# EAGLE design WeatherStation (EAGLE 7.1.0)

## Sheet 1 of 2
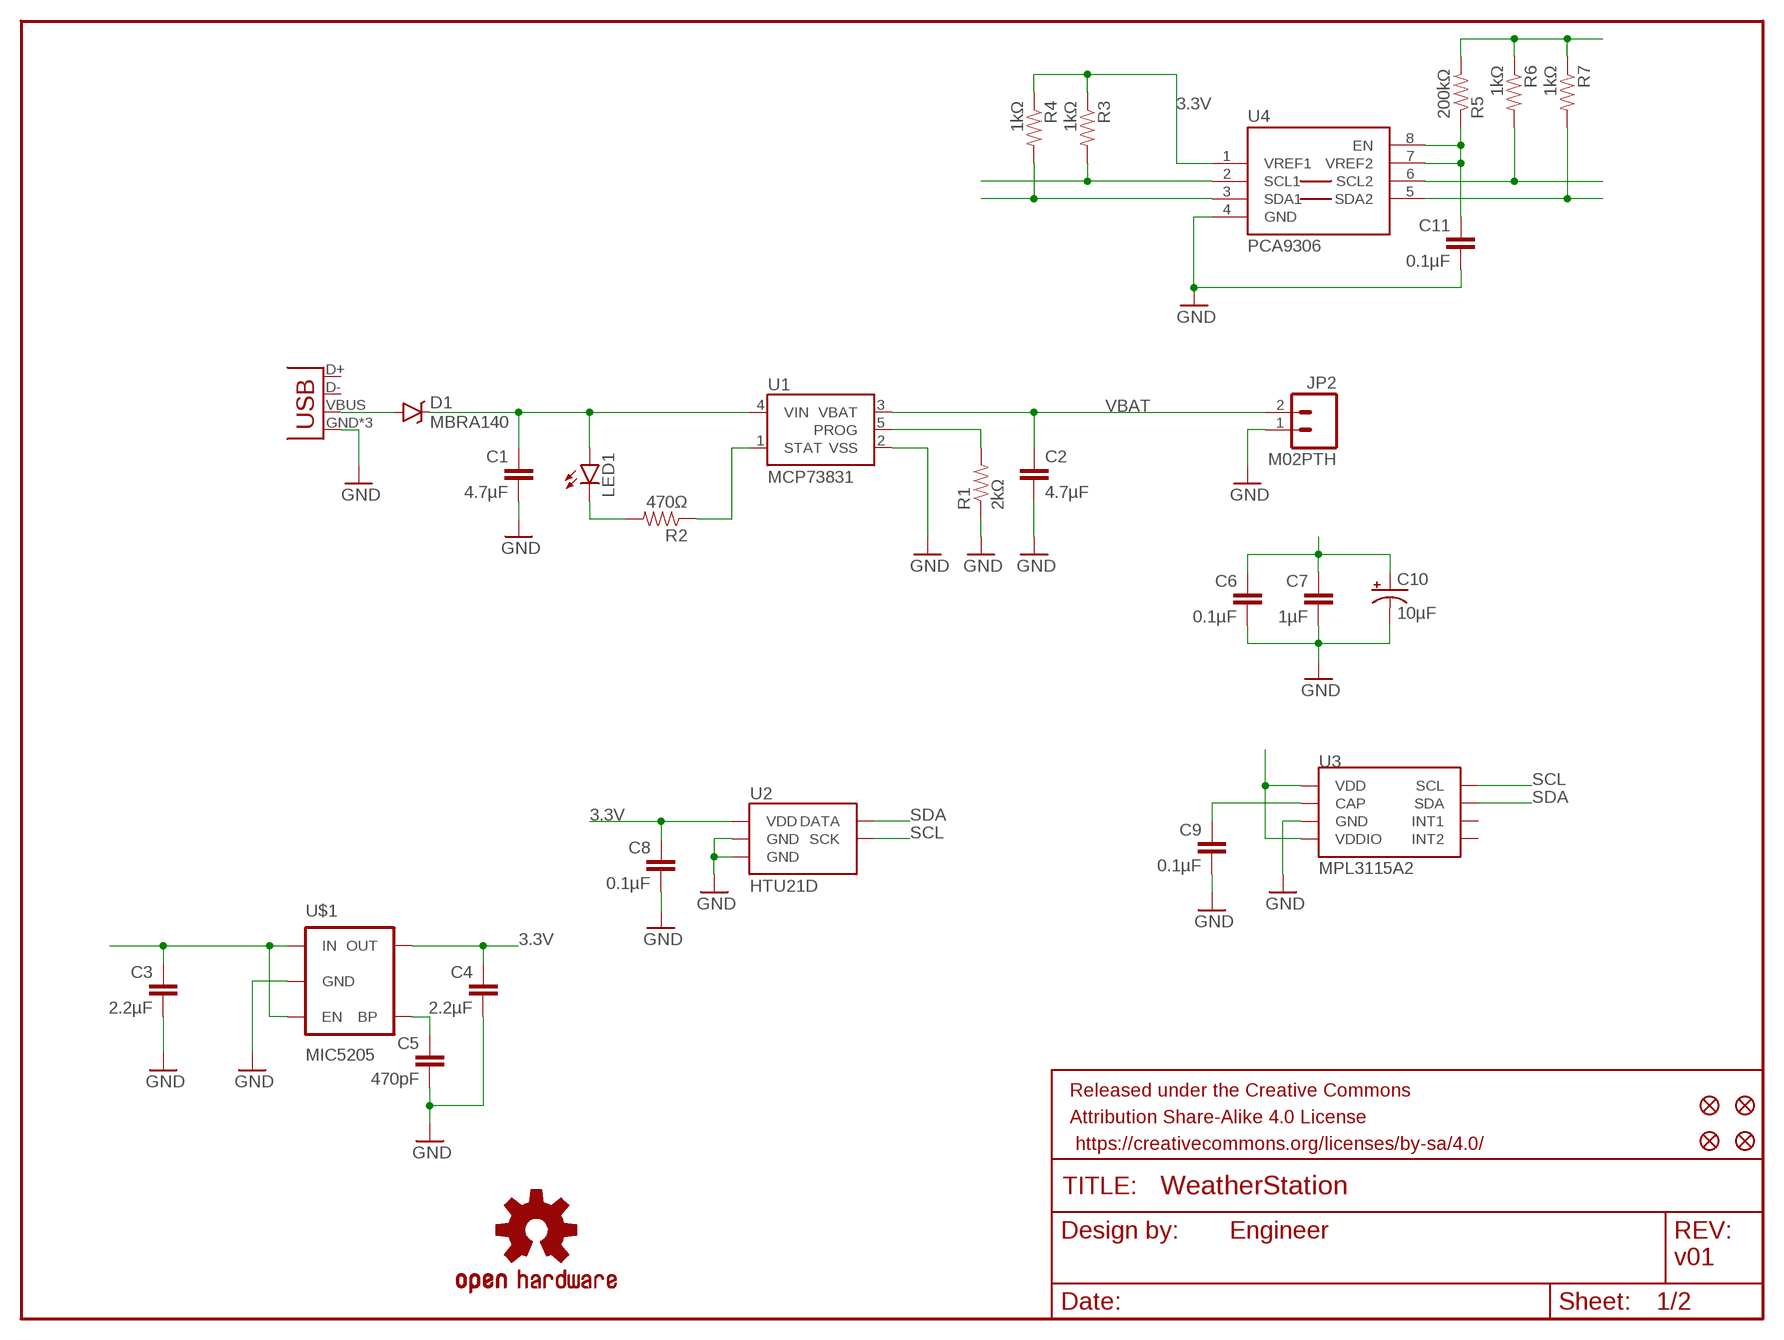
[diagram p0: schematic, sheet 1]

### Parts
C1  4.7µF  CAP0805  [0805]
C2  4.7µF  CAP0805  [0805]
C3  2.2µF  CAP0805  [0805]
C4  2.2µF  CAP0805  [0805]
C5  470pF  CAP0805  [0805]
C6  0.1µF  CAP0805  [0805]
C7  1µF  CAP0805  [0805]
C8  0.1µF  CAP0805  [0805]
C9  0.1µF  CAP0805  [0805]
C10  10µF  CAP_POL1206  [EIA3216]
C11  0.1µF  CAP0805  [0805]
D1  MBRA140  [SMA-DIODE]
FID1  FIDUCIAL1X2  [FIDUCIAL-1X2]
FID2  FIDUCIAL1X2  [FIDUCIAL-1X2]
FID3  FIDUCIAL1X2  [FIDUCIAL-1X2]
FID4  FIDUCIAL1X2  [FIDUCIAL-1X2]
FRAME1  FRAME-LETTER  [CREATIVE_COMMONS]
JP1  USB-MICROB  [USB-MICROB]
JP2  M02PTH  [1X02]
LED1  LED0603  [LED-0603]
LOGO1  OSHW-LOGOS  [OSHW-LOGO-S]
R1  2kΩ  RESISTOR0603-RES  [0603-RES]
R2  470Ω  RESISTOR0603-RES  [0603-RES]
R3  1kΩ  RESISTOR0603-RES  [0603-RES]
R4  1kΩ  RESISTOR0603-RES  [0603-RES]
R5  200kΩ  RESISTOR0603-RES  [0603-RES]
R6  1kΩ  RESISTOR0603-RES  [0603-RES]
R7  1kΩ  RESISTOR0603-RES  [0603-RES]
U1  MCP73831  [SOT23-5]
U2  HTU21D  HTU21DSMD  [HTU21D]
U3  MPL3115A2  MPL3115A2LGA8  [LGA8]
U4  PCA9306  [PSOP-8]
U$1  MIC5205  V_REG_MIC52053.3V  [SOT23-5]

### Nets
1.8V: R5.2 R6.1 R7.1 ; also sheet 2
3.3V: C4.1 C6.1 C7.1 C8.1 C10.A(+) R3.1 R4.1 U2.VDD U3.1(VDD) U3.4(VDDIO) U4.1(VREF1) U$1.5(OUT) ; also sheet 2
GND: C1.2 C2.2 C3.2 C4.2 C5.2 C6.2 C7.2 C8.2 C9.2 C10.C(-) C11.2 JP1.GND JP1.MT1(GND) JP1.MT2(GND) JP2.1 R1.1 U1.2(VSS) U2.7(GND) U2.GND U3.3(GND) U4.4(GND) U$1.2(GND) ; also sheet 2
N$1: D1.A JP1.VBUS
N$2: C1.1 D1.C LED1.A U1.4(VIN)
N$3: C9.1 U3.2(CAP)
N$4: LED1.C R2.2
N$5: R2.1 U1.1(STAT)
N$6: R1.2 U1.5(PROG)
N$8: C5.1 U$1.4(BP)
N$10: C11.1 R5.1 U4.7(VREF2) U4.8(EN)
N$11: R6.2 U4.6(SCL2)
N$12: R7.2 U4.5(SDA2)
SCL: R3.2 U2.SCK U3.8(SCL) U4.2(SCL1)
SDA: R4.2 U2.DATA U3.7(SDA) U4.3(SDA1)
VBAT: C2.1 C3.1 JP2.2 U1.3(VBAT) U$1.1(IN) U$1.3(EN)
Unconnected: JP1.D+ JP1.D- U3.5(INT2) U3.6(INT1)

### Notes on the sheet
- Engineer
- v01

## Sheet 2 of 2
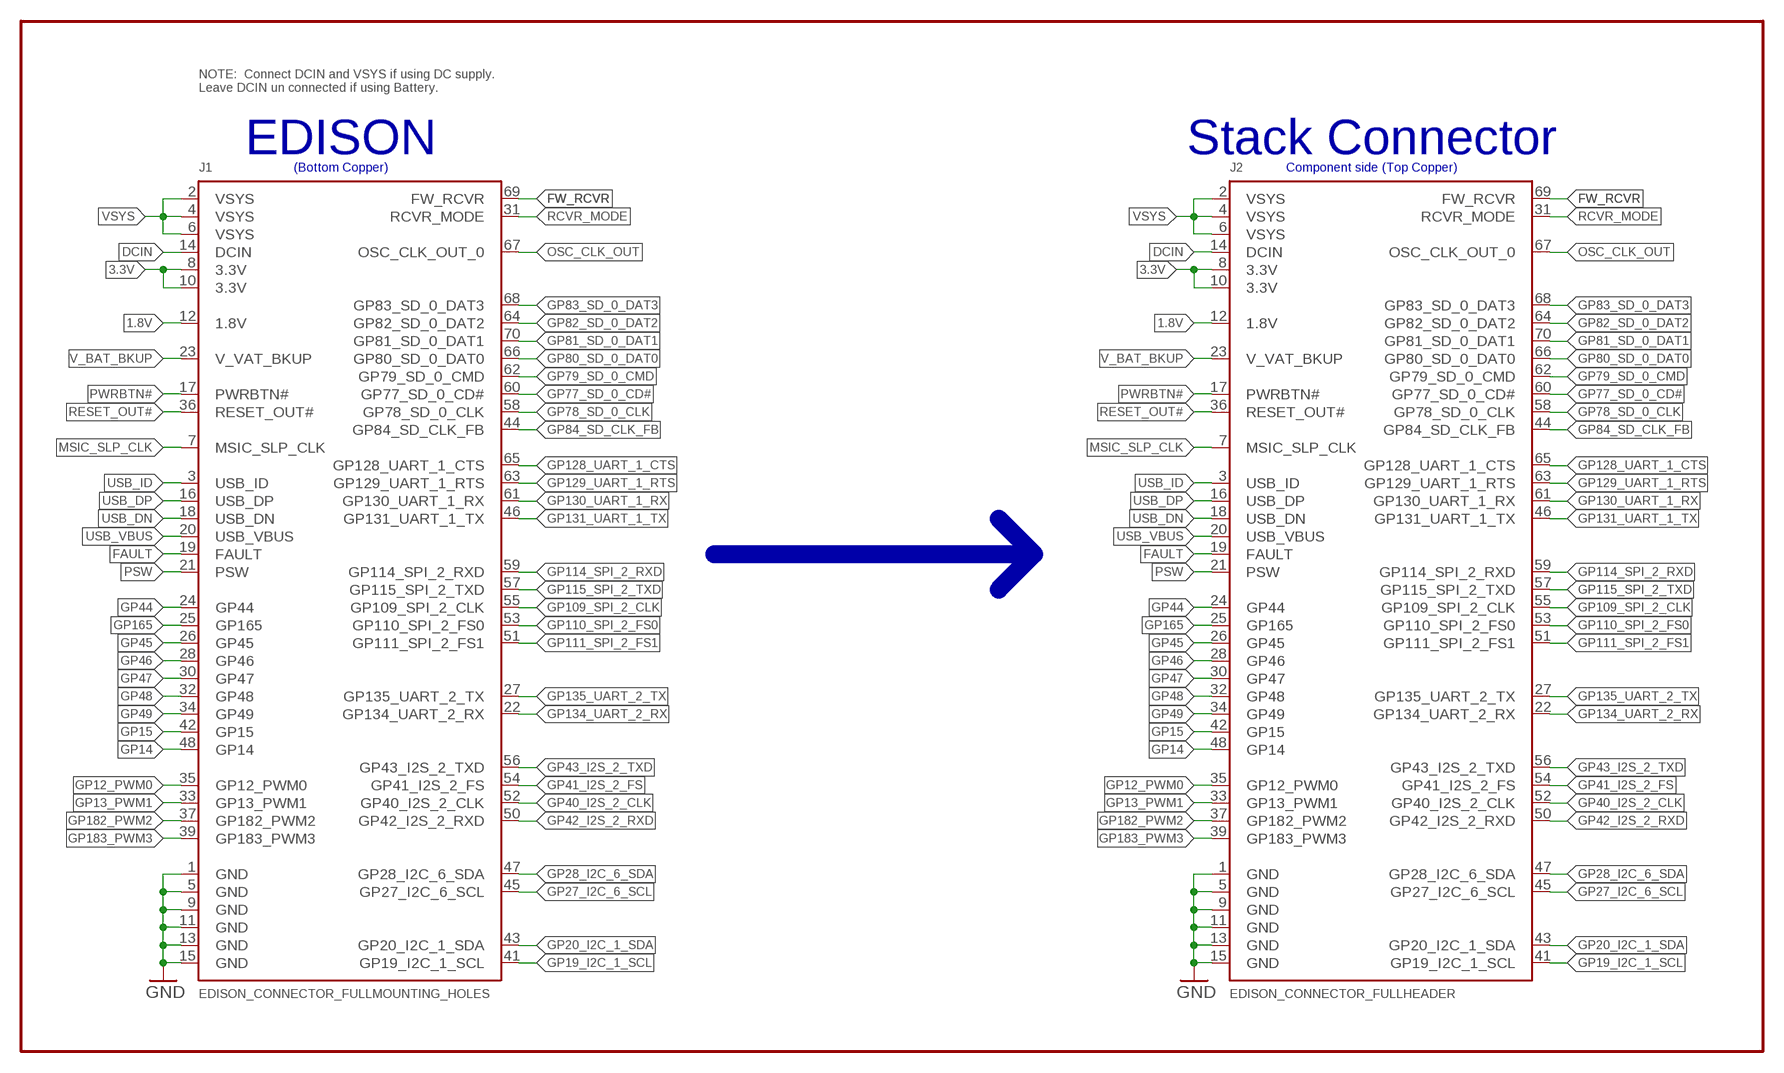
[diagram p1: schematic, sheet 2]

### Parts
J1  EDISON_CONNECTOR_FULLMOUNTING_HOLES  [EDISON_DAUGHTER]
J2  EDISON_CONNECTOR_FULLHEADER  [DF40C-70DP-0.4(51)]

### Nets
1.8V: J1.12(1.8V) J2.12(1.8V) ; also sheet 1
3.3V: J1.8(3.3V) J1.10(3.3V) J2.8(3.3V) J2.10(3.3V) ; also sheet 1
DCIN: J1.14(DCIN) J2.14(DCIN)
FAULT: J1.19(FAULT) J2.19(FAULT)
FW_RCVR: J1.69(FW_RCVR) J2.69(FW_RCVR)
GND: J1.1(GND) J1.5(GND) J1.9(GND) J1.11(GND) J1.13(GND) J1.15(GND) J2.1(GND) J2.5(GND) J2.9(GND) J2.11(GND) J2.13(GND) J2.15(GND) ; also sheet 1
GP12_PWM0: J1.35(GP12_PWM0) J2.35(GP12_PWM0)
GP13_PWM1: J1.33(GP13_PWM1) J2.33(GP13_PWM1)
GP14: J1.48(GP14) J2.48(GP14)
GP15: J1.42(GP15) J2.42(GP15)
GP19_I2C_1_SCL: J1.41(GP19_I2C_1_SCL) J2.41(GP19_I2C_1_SCL)
GP20_I2C_1_SDA: J1.43(GP20_I2C_1_SDA) J2.43(GP20_I2C_1_SDA)
GP27_I2C_6_SCL: J1.45(GP27_I2C_6_SCL) J2.45(GP27_I2C_6_SCL)
GP28_I2C_6_SDA: J1.47(GP28_I2C_6_SDA) J2.47(GP28_I2C_6_SDA)
GP40_I2S_2_CLK: J1.52(GP40_I2S_2_CLK) J2.52(GP40_I2S_2_CLK)
GP41_I2S_2_FS: J1.54(GP41_I2S_2_FS) J2.54(GP41_I2S_2_FS)
GP42_I2S_2_RXD: J1.50(GP42_I2S_2_RXD) J2.50(GP42_I2S_2_RXD)
GP43_I2S_2_TXD: J1.56(GP43_I2S_2_TXD) J2.56(GP43_I2S_2_TXD)
GP44: J1.24(GP44) J2.24(GP44)
GP45: J1.26(GP45) J2.26(GP45)
GP46: J1.28(GP46) J2.28(GP46)
GP47: J1.30(GP47) J2.30(GP47)
GP48: J1.32(GP48) J2.32(GP48)
GP49: J1.34(GP49) J2.34(GP49)
GP77_SD_0_CD#: J1.60(GP77_SD_0_CD#) J2.60(GP77_SD_0_CD#)
GP78_SD_0_CLK: J1.58(GP78_SD_0_CLK) J2.58(GP78_SD_0_CLK)
GP79_SD_0_CMD: J1.62(GP79_SD_0_CMD) J2.62(GP79_SD_0_CMD)
GP80_SD_0_DAT0: J1.66(GP80_SD_0_DAT0) J2.66(GP80_SD_0_DAT0)
GP81_SD_0_DAT1: J1.70(GP81_SD_0_DAT1) J2.70(GP81_SD_0_DAT1)
GP82_SD_0_DAT2: J1.64(GP82_SD_0_DAT2) J2.64(GP82_SD_0_DAT2)
GP83_SD_0_DAT3: J1.68(GP83_SD_0_DAT3) J2.68(GP83_SD_0_DAT3)
GP84_SD_CLK_FB: J1.44(GP84_SD_CLK_FB) J2.44(GP84_SD_CLK_FB)
GP109_SPI_2_CLK: J1.55(GP109_SPI_2_CLK) J2.55(GP109_SPI_2_CLK)
GP110_SPI_2_FS0: J1.53(GP110_SPI_2_FS0) J2.53(GP110_SPI_2_FS0)
GP111_SPI_2_FS1: J1.51(GP111_SPI_2_FS1) J2.51(GP111_SPI_2_FS1)
GP114_SPI_2_RXD: J1.59(GP114_SPI_2_RXD) J2.59(GP114_SPI_2_RXD)
GP115_SPI_2_TXD: J1.57(GP115_SPI_2_TXD) J2.57(GP115_SPI_2_TXD)
GP128_UART_1_CTS: J1.65(GP128_UART_1_CTS) J2.65(GP128_UART_1_CTS)
GP129_UART_1_RTS: J1.63(GP129_UART_1_RTS) J2.63(GP129_UART_1_RTS)
GP130_UART_1_RX: J1.61(GP130_UART_1_RX) J2.61(GP130_UART_1_RX)
GP131_UART_1_TX: J1.46(GP131_UART_1_TX) J2.46(GP131_UART_1_TX)
GP134_UART_2_RX: J1.22(GP134_UART_2_RX) J2.22(GP134_UART_2_RX)
GP135_UART_2_TX: J1.27(GP135_UART_2_TX) J2.27(GP135_UART_2_TX)
GP165: J1.25(GP165) J2.25(GP165)
GP182_PWM2: J1.37(GP182_PWM2) J2.37(GP182_PWM2)
GP183_PWM3: J1.39(GP183_PWM3) J2.39(GP183_PWM3)
MSIC_SLP_CLK: J1.7(MSIC_SLP_CLK) J2.7(MSIC_SLP_CLK)
OSC_CLK_OUT: J1.67(OSC_CLK_OUT_0) J2.67(OSC_CLK_OUT_0)
PSW: J1.21(PSW) J2.21(PSW)
PWRBTN#: J1.17(PWRBTN#) J2.17(PWRBTN#)
RCVR_MODE: J1.31(RCVR_MODE) J2.31(RCVR_MODE)
RESET_OUT#: J1.36(RESET_OUT#) J2.36(RESET_OUT#)
USB_DN: J1.18(USB_DN) J2.18(USB_DN)
USB_DP: J1.16(USB_DP) J2.16(USB_DP)
USB_ID: J1.3(USB_ID) J2.3(USB_ID)
USB_VBUS: J1.20(USB_VBUS) J2.20(USB_VBUS)
V_BAT_BKUP: J1.23(V_VAT_BKUP) J2.23(V_VAT_BKUP)
VSYS: J1.2(VSYS) J1.4(VSYS) J1.6(VSYS) J2.2(VSYS) J2.4(VSYS) J2.6(VSYS)

### Buses
B$1

### Notes on the sheet
- NOTE:  Connect DCIN and VSYS if using DC supply.
  Leave DCIN un connected if using Battery.
- EDISON | Stack Connector
- (Bottom Copper) | Component side (Top Copper)

## Library data of the parts
C1-C9 C11 = SparkFun-Capacitors:CAP: Capacitor Standard 0603 ceramic capacitor, and 0.1" leaded capacitor.
C10 = SparkFun-Capacitors:CAP_POL: Capacitor Polarized These are standard SMD and PTH capacitors. Normally 10uF, 47uF, and 100uF in electrolytic and tantalum varieties. Always verify the external diameter of the through hole cap, it varies with capacity, voltage, and manufacturer. The EIA devices should be standard.
D1 = SparkFun-DiscreteSemi:MBRA140: 40V, 1A Schottky rectifier SMA/DO-214AC package DIO-08053; PROD_ID: DIO-08053
FID1-FID4 = SparkFun-Aesthetics:FIDUCIAL: Fiducial Alignment Points Various fiducial points for machine vision alignment.
FRAME1 = SparkFun-Aesthetics:FRAME-LETTER: Schematic Frame Standard 8.5x11 US Letter frame
J1 J2 = Edison:EDISON_CONNECTOR_FULL
JP1 = SparkFun-Connectors:USB: USB Connectors USB-B-PTH is fully proven SKU : PRT-00139/CONN-08278 USB-miniB is fully proven SKU : PRT-00587 USB-A-PCB is untested. USB-A-H is throughly reviewed, but untested. Spark Fun Electronics SKU : PRT-00437 USB-B-SMT is throughly reviewed, but untested. Needs silkscreen touching up. USB-A-S has not been used/tested USB-MB-H has not been used/tested USB-MICROB has been used. CONN-09505; PROD_ID: CONN-09505
JP2 = SparkFun-Connectors:M02: Standard 2-pin 0.1" header. Use with - straight break away headers ( PRT-00116) - right angle break away headers (PRT-00553) - swiss pins (PRT-00743) - machine pins (PRT-00117) - female headers (PRT-00115) Molex polarized connector foot print use with: PRT-08233 with associated crimp pins and housings. 2.54_SCREWTERM for use with PRT-10571. 3.5mm Screw Terminal footprints for PRT-08084 5mm Screw Terminal footprints for use with PRT-08432
LED1 = SparkFun-LED:LED: LEDs Standard schematic elements and footprints for 5mm, 3mm, 1206, and 0603 sized LEDs. 5mm - Spark Fun Electronics SKU : COM-00529 (and others)
LOGO1 = SparkFun-Aesthetics:OSHW-LOGO: Open Source Hardware Logo This logo indicates the piece of hardware it is found on incorporates a OSHW license and/or adheres to the definition of open source hardware found here: http://freedomdefined.org/OSHW
R1-R7 = SparkFun-Resistors:RESISTOR: Resistor Basic schematic elements and footprints for 0603, 1206, and PTH resistors.
U1 = SparkFun-PowerIC:MCP73831: Miniature single cell, fully integrated Li-Ion, Li-polymer charge management controller http://ww1.microchip.com/downloads/en/DeviceDoc/21984a.pdf IC-09995; PROD_ID: IC-09995
U2 = SparkFun-Sensors:HTU21D
U3 = SparkFun-Sensors:MPL3115A2: Altimeter/Pressure Sensor, I2C, 1.95V-3.6V supply, 50 to 110kPa
U4 = SparkFun-DigitalIC:PCA9306: Bidirectional I2C level shifter. NOT compatible with all available part number pinout schemes- DOUBLE CHECK!!!; PROD_ID: IC-10023
U$1 = SparkFun-PowerIC:V_REG_MIC5205: V_REG MIC5219 Standard 3.3V and 5V 150mA LDO voltage regulator in SOT-23 layout. Micrel part MIC5205. BP (by-pass) pin is used to lower output noise with 470pF cap, may be left open.; PROD_ID: VREG-00822; VALUE: 3.3V/150mA

## Board
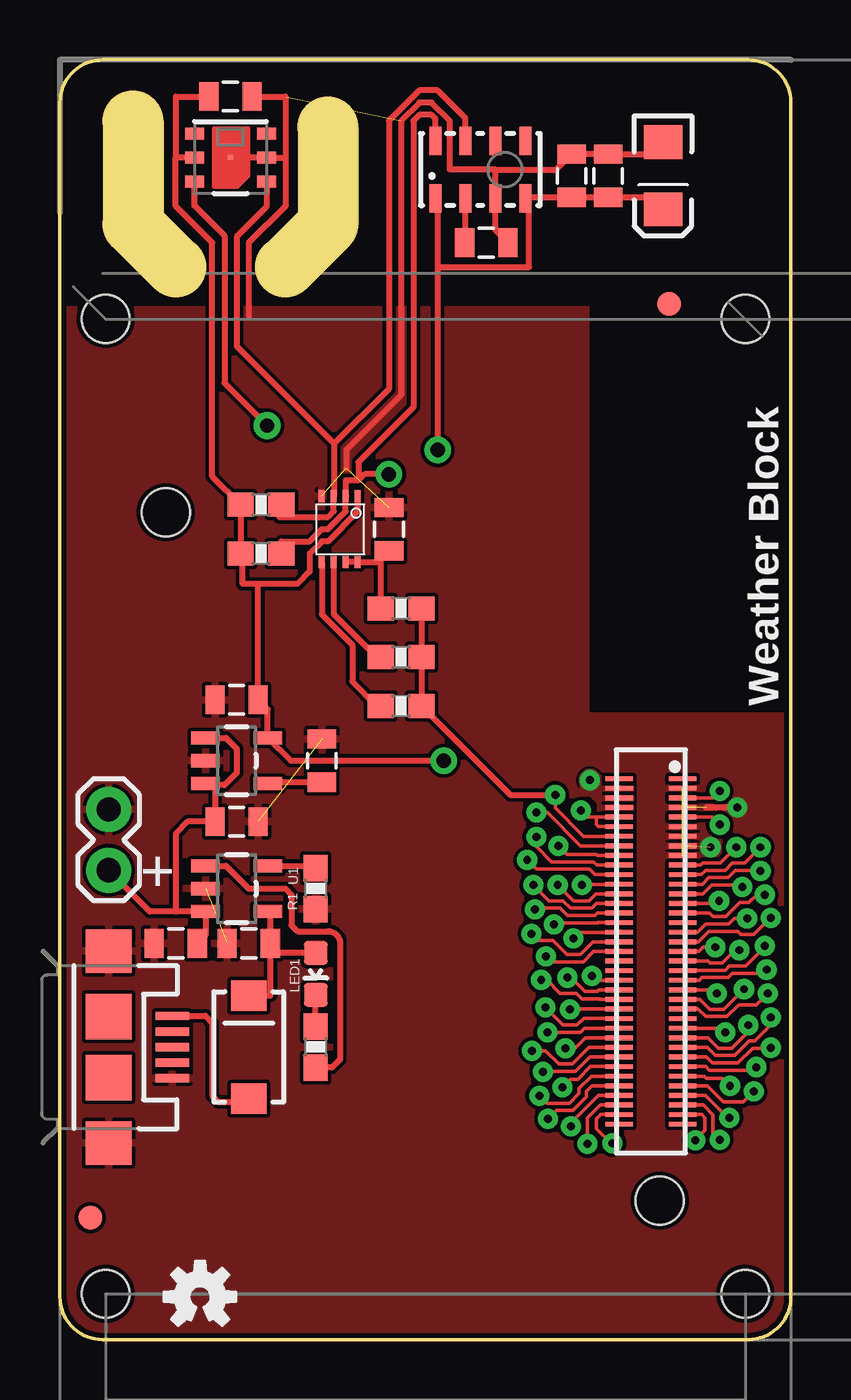
[diagram p2: board, top side]
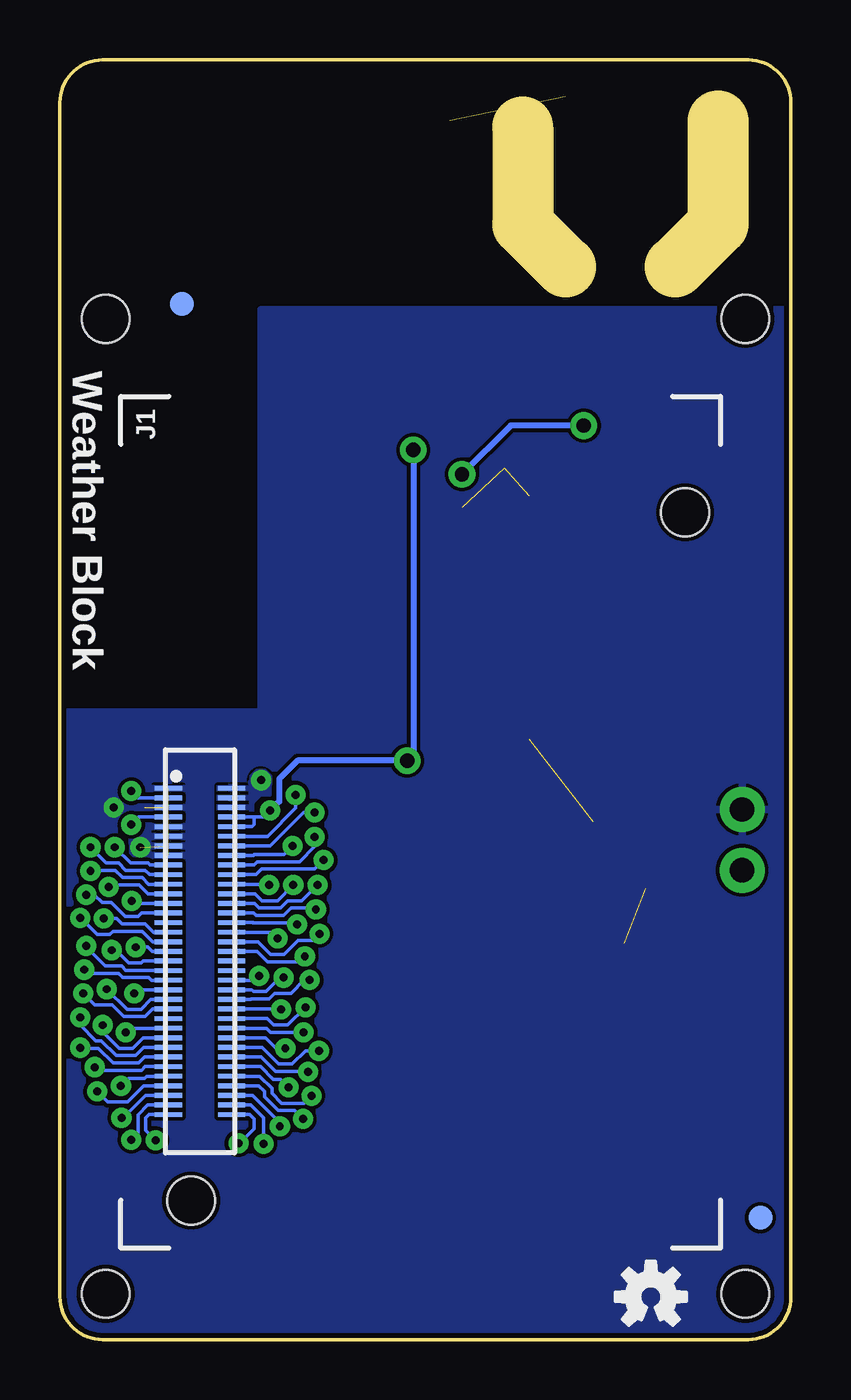
[diagram p3: board, bottom side, seen from below]

Size 30.48 x 53.34 mm. Coordinates in mm from the lower left corner, seen from the top.
Outline: 30.48,51.56 30.48,1.78 arc-90 28.7,0 1.78,0 arc-90 0,1.78 0,51.56 arc-90 1.78,53.34 28.7,53.34 arc-90 30.48,51.56
Copper layers (1*16): Top 0.035mm / dielectric 1.5mm / Bottom 0.035mm
Design rules "SparkFun-2-layer *": minimum track width 6mil, minimum drill 13mil, track to track 6mil, track to pad 6mil, pad to pad 6mil, via to via 6mil, smd to smd 6mil, copper to edge 8mil, drill to drill 8mil, minimum pad ring 12mil, minimum via ring 10mil, stop-mask expansion 4mil, vias tented up to drill 20mil, thermal gap 6mil
Holes 2 mm at 28.57,1.91 1.91,1.91 1.91,42.55 28.57,42.55
tRestrict: area 22.1,26.2 to 30.5,44.5
Milling: 4 lines

### Footprints (pad centres in the part's own frame; a part is rotated, then mirrored left to right if it is on the bottom)
0805 = smd 0.8 x 1.2: 1 -0.9,0; 2 0.9,0
EIA3216 = smd 1.4 x 1.6: A 1.4,0; C -1.4,0
SMA-DIODE = smd 1.27 x 1.47: A -2.15,0; C 2.15,0
FIDUCIAL-1X2 = smd 1 x 1: 1 0,0
EDISON_DAUGHTER = smd 1.14 x 0.2: 1 1.98,19.17; 2 4.62,19.17; 3 1.98,18.77; 4 4.62,18.77; 5 1.98,18.37; 6 4.62,18.37; 7 1.98,17.97; 8 4.62,17.97; 9 1.98,17.57; 10 4.62,17.57; 11 1.98,17.17; 12 4.62,17.17; 13 1.98,16.77; 14 4.62,16.77; 15 1.98,16.37; 16 4.62,16.37; 17 1.98,15.97; 18 4.62,15.97; 19 1.98,15.57; 20 4.62,15.57; 21 1.98,15.17; 22 4.62,15.17; 23 1.98,14.77; 24 4.62,14.77; 25 1.98,14.37; 26 4.62,14.37; 27 1.98,13.97; 28 4.62,13.97; 29 1.98,13.57; 30 4.62,13.57; 31 1.98,13.17; 32 4.62,13.17; 33 1.98,12.77; 34 4.62,12.77; 35 1.98,12.37; 36 4.62,12.37; 37 1.98,11.97; 38 4.62,11.97; 39 1.98,11.57; 40 4.62,11.57; 41 1.98,11.17; 42 4.62,11.17; 43 1.98,10.77; 44 4.62,10.77; 45 1.98,10.37; 46 4.62,10.37; 47 1.98,9.97; 48 4.62,9.97; 49 1.98,9.57; 50 4.62,9.57; 51 1.98,9.17; 52 4.62,9.17; 53 1.98,8.77; 54 4.62,8.77; 55 1.98,8.37; 56 4.62,8.37; 57 1.98,7.97; 58 4.62,7.97; 59 1.98,7.57; 60 4.62,7.57; 61 1.98,7.17; 62 4.62,7.17; 63 1.98,6.77; 64 4.62,6.77; 65 1.98,6.37; 66 4.62,6.37; 67 1.98,5.97; 68 4.62,5.97; 69 1.98,5.57; 70 4.62,5.57 | hole 2: 23.53,30.67; 2.93,1.98
DF40C-70DP-0.4(51) = smd 0.2 x 1.14 bottom: 1 6.8,1.32; 2 6.8,-1.32; 3 6.4,1.32; 4 6.4,-1.32; 5 6,1.32; 6 6,-1.32; 7 5.6,1.32; 8 5.6,-1.32; 9 5.2,1.32; 10 5.2,-1.32; 11 4.8,1.32; 12 4.8,-1.32; 13 4.4,1.32; 14 4.4,-1.32; 15 4,1.32; 16 4,-1.32; 17 3.6,1.32; 18 3.6,-1.32; 19 3.2,1.32; 20 3.2,-1.32; 21 2.8,1.32; 22 2.8,-1.32; 23 2.4,1.32; 24 2.4,-1.32; 25 2,1.32; 26 2,-1.32; 27 1.6,1.32; 28 1.6,-1.32; 29 1.2,1.32; 30 1.2,-1.32; 31 0.8,1.32; 32 0.8,-1.32; 33 0.4,1.32; 34 0.4,-1.32; 35 0,1.32; 36 0,-1.32; 37 -0.4,1.32; 38 -0.4,-1.32; 39 -0.8,1.32; 40 -0.8,-1.32; 41 -1.2,1.32; 42 -1.2,-1.32; 43 -1.6,1.32; 44 -1.6,-1.32; 45 -2,1.32; 46 -2,-1.32; 47 -2.4,1.32; 48 -2.4,-1.32; 49 -2.8,1.32; 50 -2.8,-1.32; 51 -3.2,1.32; 52 -3.2,-1.32; 53 -3.6,1.32; 54 -3.6,-1.32; 55 -4,1.32; 56 -4,-1.32; 57 -4.4,1.32; 58 -4.4,-1.32; 59 -4.8,1.32; 60 -4.8,-1.32; 61 -5.2,1.32; 62 -5.2,-1.32; 63 -5.6,1.32; 64 -5.6,-1.32; 65 -6,1.32; 66 -6,-1.32; 67 -6.4,1.32; 68 -6.4,-1.32; 69 -6.8,1.32; 70 -6.8,-1.32; NC1 7.2,1.32; NC2 7.2,-1.32; NC3 -7.2,-1.32; NC4 -7.2,1.32
USB-MICROB = smd 0.35 x 1.4: D+ 0,2.65; D- -0.65,2.65; GND 1.3,2.65; ID 0.65,2.65; VBUS -1.3,2.65 | smd 1.8 x 1.9: MT1 -4,0; MT2 4,0 | smd 1.9 x 1.9: P$1 -1.27,0; P$2 1.27,0
1X02 = drill 1.016 pad 1.88: 1 0,0; 2 2.54,0
LED-0603 = smd 1 x 1: A 0,-0.877; C 0,0.877
0603-RES = smd 1.1 x 1: 1 -0.85,0; 2 0.85,0
SOT23-5 = smd 0.55 x 1.2: 1 -0.95,-1.3; 2 0,-1.3; 3 0.95,-1.3; 4 0.95,1.3; 5 -0.95,1.3
HTU21D = smd 0.2 x 0.2: 7 0,0 | smd 0.8 x 0.5: DATA 1.5,-1; GND 1.5,0; NC@1 -1.5,1; NC@6 1.5,1; SCK -1.5,-1; VDD -1.5,0
LGA8 = smd 1.2 x 0.5: 1 -1.2,1.875; 2 -1.2,0.625; 3 -1.2,-0.625; 4 -1.2,-1.875; 5 1.2,-1.875; 6 1.2,-0.625; 7 1.2,0.625; 8 1.2,1.875
PSOP-8 = smd 0.25 x 0.5: 1 -0.73,-1.37; 2 -0.23,-1.37; 3 0.27,-1.37; 4 0.77,-1.37; 5 0.77,1.38; 6 0.27,1.38; 7 -0.23,1.38; 8 -0.73,1.38

### Placement (x,y rotation side)
C1  7.87,16.51 180 top
C2  4.83,16.51 180 top
C3  7.37,21.59 0 top
C4  7.37,26.67 180 top
C5  10.92,24.13 90 top
C6  21.34,48.51 90 top
C7  22.86,48.51 90 top
C8  7.11,51.82 0 top
C9  17.78,45.72 0 top
C10  25.15,48.51 270 top
C11  13.72,33.78 90 top
D1  7.87,12.19 90 top
FID1  1.27,5.08 0 top
FID2  25.4,43.18 0 top
FID3  1.27,5.08 0 bottom
FID4  25.4,43.18 0 bottom
FRAME1  -1.27,-13.97 0 top  (outside the outline)
J1  27.94,3.81 0 bottom
J2  24.64,16.18 90 bottom
JP1  2.03,12.19 270 top
JP2  2.03,22.1 270 top
LED1  10.67,15.24 180 top
LOGO1  5.84,1.78 0 top
LOGO2  OSHW-LOGOS  [OSHW-LOGO-S]  5.84,1.78 0 bottom
R1  10.67,18.8 90 top
R2  10.67,12.19 90 top
R3  8.38,32.77 0 top
R4  8.38,34.8 0 top
R5  14.22,30.48 0 top
R6  14.22,28.45 180 top
R7  14.22,26.42 180 top
U1  7.37,18.8 270 top
U2  7.11,49.28 0 top
U3  17.53,48.77 90 top
U4  11.68,33.78 180 top
U$1  7.37,24.13 270 top

### Tracks (layer width: path | path; a pad name or v marks a point on that pad's centre or on a via)
1.8V  (via drill 0.33)
  Top 0.152: J2.12 21.82,20.98 20.65,22.15 v20.65,22.71
  Top 0.254: R5.2 R6.1 R7.1 18.78,22.71 v20.65,22.71
  Bottom 0.152: v20.65,22.71 20.65,22.15 21.82,20.98 J2.12 | J2.12
3.3V  (via drill 0.33, 0.6 pad 0.25)
  Top 0.152: J2.8 | v21.72,22.05 21.98,21.78 22.38,21.78 | 22.38,21.78 J2.8 | J2.10 22.46,21.38 22.38,21.46 22.38,21.78
  Top 0.254: 4.83,49.28 4.83,51.82 C8.1 | C10.A arc90 24.65,47.61 C7.1 C6.1 19.45,47.61 U3.4 19.56,47.57 19.56,44.7 15.75,44.7 | U3.1 15.75,47.47 15.75,44.7 | 8.27,31.5 C4.1 8.67,26.27 U$1.5 9.62,24.13 v16,24.13 | 8.27,31.5 7.62,31.5 7.62,32.77 R3.1 R4.1 6.35,35.98 6.35,45.72 4.83,47.24 4.83,49.28 | U4.1 12.41,34.51 11.18,33.27 10.92,33.27 10.41,32.77 10.41,32 9.91,31.5 8.27,31.5 | 15.75,44.7 v15.75,37.08 | U2.VDD 4.83,49.28
  Bottom 0.152: J2.8 22.38,21.78 | 22.38,21.78 21.98,21.78 v21.72,22.05 | J2.10 22.46,21.38 22.38,21.46 22.38,21.78
  Bottom 0.254: v21.72,22.05 21.34,22.43 21.34,23.37 20.57,24.13 v16,24.13 15.75,24.38 v15.75,37.08
DCIN  (via drill 0.33)
  Top 0.152: J2.14 21.8,20.58 | v19.86,21.97 20.32,21.97 21.71,20.58 21.8,20.58 | 21.8,20.58
  Bottom 0.152: v19.86,21.97 20.32,21.97 21.71,20.58 J2.14
FAULT  (via drill 0.33)
  Top 0.152: J2.19 26.75,19.38 26.92,19.56 27.74,19.56 28.04,19.86 28.55,19.86 v29.21,20.52
  Bottom 0.152: v29.21,20.52 28.55,19.86 28.04,19.86 27.74,19.56 26.92,19.56 26.75,19.38 J2.19
FW_RCVR  (via drill 0.33)
  Top 0.152: v26.49,8.31 26.9,8.71 26.9,9.25 26.76,9.38 J2.69
  Bottom 0.152: J2.69 26.76,9.38 26.9,9.25 26.9,8.71 v26.49,8.31
GND  (via drill 0.33)  (18 unrouted)
  Top 0.152: 26.94,22.18 26.95,22.17
  Top 0.254: U2.7 U2.GND 9.4,49.28 | C9.2 18.15,46.25 U3.3 18.15,48.77 | 18.15,48.77 20.69,48.77 C6.2 C7.2 24.65,49.41 C10.C | 18.15,48.77 16.26,48.77 16.26,50.8 15.49,51.56 14.99,51.56 14.22,50.8 14.22,39.37 11.94,37.08 11.94,36.32 | C8.2 9.4,51.82 9.4,49.28 | 9.4,49.28 9.4,47.24 7.87,45.72 7.87,42.67 | v28.25,22.17 v28.24,22.18 26.95,22.18 26.95,22.17
  other vias: 27.13,20.52
  pour Top: 0,42.93 30.48,42.93 30.48,2.03 30.48,1.78 arc-90 28.7,0 1.78,0 arc-90 0,1.78
  pour Bottom: 0,42.93 22.1,42.93 22.1,26.16 30.48,26.16 30.48,1.78 arc-90 28.7,0 1.78,0 arc-90 0,1.78
GP12_PWM0  (via drill 0.33)
  Top 0.152: J2.35 26.64,16.18 26.82,16.36 v27.33,16.36
  Bottom 0.152: v27.33,16.36 26.82,16.36 26.64,16.18 J2.35 | J2.35
GP13_PWM1  (via drill 0.33)
  Top 0.152: v29.64,17.58 29.62,17.58 28.93,16.89 28.4,16.89 28.27,17.02 27.05,17.02 26.61,16.58 J2.33
  Bottom 0.152: J2.33 26.61,16.58 27.05,17.02 28.27,17.02 28.4,16.89 28.93,16.89 29.62,17.58 v29.64,17.58
GP14  (via drill 0.33)
  Top 0.152: v21.26,13.77 21.27,13.78 J2.48
  Bottom 0.152: J2.48 21.27,13.78 v21.26,13.77
GP15  (via drill 0.33)
  Top 0.152: J2.42 22.36,14.98 v22.17,15.16
  Bottom 0.152: v22.17,15.16 22.36,14.98 J2.42
GP19_I2C_1_SCL  (via drill 0.33)
  Top 0.152: J2.41 26.66,14.98 26.77,15.09 27.86,15.09 28.04,15.27 29.31,15.27 v29.46,15.42
  Bottom 0.152: v29.46,15.42 29.31,15.27 28.04,15.27 27.86,15.09 26.77,15.09 26.66,14.98 J2.41
GP20_I2C_1_SDA  (via drill 0.33)
  Top 0.152: J2.43 27.23,14.58 v27.38,14.43
  Bottom 0.152: v27.38,14.43 27.23,14.58 J2.43 | J2.43
GP27_I2C_6_SCL  (via drill 0.33)
  Top 0.152: v28.52,14.61 27.69,13.77 27.1,13.77 26.69,14.18 J2.45
  Bottom 0.152: J2.45 26.69,14.18 27.1,13.77 27.69,13.77 v28.52,14.61
GP28_I2C_6_SDA  (via drill 0.33)
  Top 0.152: J2.47 26.61,13.78 26.92,13.46 27.81,13.46 28.3,13.95 29.03,13.95 v29.52,14.43
  Bottom 0.152: v29.52,14.43 29.03,13.95 28.3,13.95 27.81,13.46 26.92,13.46 26.61,13.78 J2.47
GP40_I2S_2_CLK  (via drill 0.33)
  Top 0.152: J2.52 21.87,12.98 21.69,12.8 v20.32,12.8
  Bottom 0.152: v20.32,12.8 21.69,12.8 21.87,12.98 J2.52
GP41_I2S_2_FS  (via drill 0.33)
  Top 0.152: v21.08,12.14 21.46,12.14 21.9,12.58 J2.54
  Bottom 0.152: J2.54 21.9,12.58 21.46,12.14 v21.08,12.14
GP42_I2S_2_RXD  (via drill 0.33)
  Top 0.152: J2.50 21.84,13.38 21.57,13.11 20.98,13.11 v20.24,13.84
  Bottom 0.152: v20.24,13.84 20.98,13.11 21.57,13.11 21.84,13.38 J2.50
GP43_I2S_2_TXD  (via drill 0.33)
  Top 0.152: J2.56 22.06,12.18 21.36,11.48 20.8,11.48 20.24,12.04 v19.68,12.04
  Bottom 0.152: v19.68,12.04 20.24,12.04 20.8,11.48 21.36,11.48 22.06,12.18 J2.56
GP44  (via drill 0.33)
  Top 0.152: J2.24 22.34,18.58 22.05,18.29 21.41,18.29 v20.75,18.95
  Bottom 0.152: v20.75,18.95 21.41,18.29 22.05,18.29 22.34,18.58 J2.24
GP45  (via drill 0.33)
  Top 0.152: v19.74,18.95 20.4,18.29 20.98,18.29 21.29,17.98 22.17,17.98 22.37,18.18 J2.26
  Bottom 0.152: J2.26 22.37,18.18 22.17,17.98 21.29,17.98 20.98,18.29 20.4,18.29 v19.74,18.95
GP46  (via drill 0.33)
  Top 0.152: J2.28 22.4,17.78 22.3,17.68 21.16,17.68 20.85,17.98 19.86,17.98 v19.81,17.93
  Bottom 0.152: v19.81,17.93 19.86,17.98 20.85,17.98 21.16,17.68 22.3,17.68 22.4,17.78 J2.28
GP47  (via drill 0.33)
  Top 0.152: J2.30 22.43,17.38 22.43,17.37 20.68,17.37 v20.6,17.3
  Bottom 0.152: v20.6,17.3 20.68,17.37 22.43,17.37 22.43,17.38 J2.30
GP48  (via drill 0.33)
  Top 0.152: v21.41,16.71 21.68,16.98 J2.32
  Bottom 0.152: J2.32 21.68,16.98 v21.41,16.71
GP49  (via drill 0.33)
  Top 0.152: J2.34 22.22,16.58 21.69,16.05 21.13,16.05 20.55,16.64 19.94,16.64 v19.66,16.92
  Bottom 0.152: v19.66,16.92 19.94,16.64 20.55,16.64 21.13,16.05 21.69,16.05 22.22,16.58 J2.34
GP77_SD_0_CD#  (via drill 0.33)
  Top 0.152: J2.60 22.12,11.38 21.59,10.85 21.29,10.85 v20.95,10.52
  Bottom 0.152: v20.95,10.52 21.29,10.85 21.59,10.85 22.12,11.38 J2.60
GP78_SD_0_CLK  (via drill 0.33)
  Top 0.152: J2.58 22.09,11.78 21.49,11.18 20.17,11.18 v20.14,11.15
  Bottom 0.152: v20.14,11.15 20.17,11.18 21.49,11.18 22.09,11.78 J2.58
GP79_SD_0_CMD  (via drill 0.33)
  Top 0.152: J2.62 22.16,10.98 21.64,10.46 21.64,10.26 21.23,9.86 20.3,9.86 v19.99,10.16
  Bottom 0.152: v19.99,10.16 20.3,9.86 21.23,9.86 21.64,10.26 21.64,10.46 22.16,10.98 J2.62
GP80_SD_0_DAT0  (via drill 0.33)
  Top 0.152: v21.31,8.89 21.31,9.04 22.45,10.18 J2.66
  Bottom 0.152: J2.66 22.45,10.18 21.31,9.04 v21.31,8.89
GP81_SD_0_DAT1  (via drill 0.33)
  Top 0.152: J2.70 22.56,9.38 22.38,9.2 22.38,8.79 22.99,8.18 v23.04,8.18
  Bottom 0.152: v23.04,8.18 22.99,8.18 22.38,8.79 22.38,9.2 22.56,9.38 J2.70
GP82_SD_0_DAT2  (via drill 0.33)
  Top 0.152: J2.64 22.19,10.58 21.95,10.34 21.95,10.11 21.39,9.55 20.7,9.55 v20.34,9.2
  Bottom 0.152: v20.34,9.2 20.7,9.55 21.39,9.55 21.95,10.11 21.95,10.34 22.19,10.58 J2.64
GP83_SD_0_DAT3  (via drill 0.33)
  Top 0.152: v22,8.15 22,9.25 22.53,9.78 J2.68
  Bottom 0.152: J2.68 22.53,9.78 22,9.25 v22,8.15
GP84_SD_CLK_FB  (via drill 0.33)
  Top 0.152: J2.44 22.48,14.58 22.4,14.5 21.89,14.5 21.31,15.09 v21.16,15.09
  Bottom 0.152: v21.16,15.09 21.31,15.09 21.89,14.5 22.4,14.5 22.48,14.58 J2.44 | J2.44
GP109_SPI_2_CLK  (via drill 0.33)
  Top 0.152: J2.55 26.99,12.18 27.33,11.84 28.14,11.84 28.75,12.45 28.98,12.45 29.64,13.11 v29.64,13.44
  Bottom 0.152: v29.64,13.44 29.64,13.11 28.98,12.45 28.75,12.45 28.14,11.84 27.33,11.84 26.99,12.18 J2.55
GP110_SPI_2_FS0  (via drill 0.33)
  Top 0.152: v28.7,13.11 28.7,12.83 28.02,12.14 27.46,12.14 27.02,12.58 J2.53
  Bottom 0.152: J2.53 27.02,12.58 27.46,12.14 28.02,12.14 28.7,12.83 v28.7,13.11
GP111_SPI_2_FS1  (via drill 0.33)
  Top 0.152: v27.74,12.8 27.56,12.98 J2.51
  Bottom 0.152: J2.51 27.56,12.98 v27.74,12.8
GP114_SPI_2_RXD  (via drill 0.33)
  Top 0.152: J2.59 26.92,11.38 27.08,11.23 28.91,11.23 v29.03,11.35
  Bottom 0.152: J2.59 26.92,11.38 27.08,11.23 28.91,11.23 v29.03,11.35
GP115_SPI_2_TXD  (via drill 0.33)
  Top 0.152: J2.57 26.95,11.78 27.2,11.53 28.27,11.53 28.88,12.14 29.62,12.14 v29.64,12.17
  Bottom 0.152: J2.57 26.95,11.78 27.2,11.53 28.27,11.53 28.88,12.14 29.62,12.14 v29.64,12.17
GP128_UART_1_CTS  (via drill 0.33)
  Top 0.152: J2.65 26.9,10.18 27.84,9.25 v27.91,9.25
  Bottom 0.152: v27.91,9.25 27.84,9.25 26.9,10.18 J2.65
GP129_UART_1_RTS  (via drill 0.33)
  Top 0.152: v28.93,10.34 28.5,9.91 27.66,9.91 26.99,10.58 J2.63
  Bottom 0.152: J2.63 26.99,10.58 27.66,9.91 28.5,9.91 v28.93,10.34
GP130_UART_1_RX  (via drill 0.33)
  Top 0.152: v27.94,10.57 27.61,10.9 26.95,10.9 26.87,10.98 J2.61
  Bottom 0.152: J2.61 26.87,10.98 26.95,10.9 27.61,10.9 v27.94,10.57
GP131_UART_1_TX  (via drill 0.33)
  Top 0.152: J2.46 22.52,14.18 22.5,14.2 21.77,14.2 21.54,14.43 20.85,14.43 20.3,14.99 v20.07,14.99
  Bottom 0.152: v20.07,14.99 20.3,14.99 20.85,14.43 21.54,14.43 21.77,14.2 22.5,14.2 22.52,14.18 J2.46
GP134_UART_2_RX  (via drill 0.33)
  Top 0.152: v21.77,18.95 21.8,18.98 J2.22
  Bottom 0.152: J2.22 21.8,18.98 v21.77,18.95
GP135_UART_2_TX  (via drill 0.33)
  Top 0.152: v29.39,18.54 29.06,18.54 28.73,18.21 28.35,18.21 27.76,17.63 27.23,17.63 27.08,17.78 J2.27
  Bottom 0.152: J2.27 27.08,17.78 27.23,17.63 27.76,17.63 28.35,18.21 28.73,18.21 29.06,18.54 v29.39,18.54
GP165  (via drill 0.33)
  Top 0.152: v27.48,18.29 27.38,18.18 J2.25
  Bottom 0.152: J2.25 27.38,18.18 v27.48,18.29
GP182_PWM2  (via drill 0.33)
  Top 0.152: J2.37 27.02,15.78 27.1,15.7 27.61,15.7 28.14,16.23 v28.32,16.23
  Bottom 0.152: v28.32,16.23 28.14,16.23 27.61,15.7 27.1,15.7 27.02,15.78 J2.37
GP183_PWM3  (via drill 0.33)
  Top 0.152: v29.39,16.41 29.39,16.36 28.6,15.57 27.91,15.57 27.74,15.39 26.62,15.39 26.61,15.38 J2.39
  Bottom 0.152: J2.39 26.61,15.38 26.62,15.39 27.74,15.39 27.91,15.57 28.6,15.57 29.39,16.36 v29.39,16.41
MSIC_SLP_CLK  (via drill 0.33)
  Top 0.152: v27.51,21.46 27.19,21.78 J2.7
  Bottom 0.152: J2.7 27.19,21.78 v27.51,21.46
N$1
  Top 0.254: JP1.VBUS 6.07,13.49 6.35,13.21 6.35,10.16 6.6,9.91 7.74,9.91 D1.A
N$2
  Top 0.254: D1.C 8.77,14.34 C1.1 | C1.1 8.77,17.74 U1.4 | LED1.A 9.17,16.12 arc-90 C1.1
N$3
  Top 0.254: C9.1 16.9,45.74 U3.2
N$4
  Top 0.254: R2.2 LED1.C
N$5
  Top 0.254: R2.1 11.34,11.34 11.68,11.68 11.68,16.51 arc90 11.18,17.02 9.91,17.02 9.65,17.27 9.65,18.54 9.4,18.8 7.87,18.8 6.92,19.75 U1.1
N$6
  Top 0.254: U1.5 10.67,19.75 R1.2
N$8
  Top 0.254: C5.1 8.72,23.23 U$1.4
N$10
  Top 0.254: R5.1 13.37,32.54 C11.1 13.24,32.4 U4.8 U4.7
N$11
  Top 0.254: U4.6 11.41,30.24 13.21,28.45 R6.2
N$12
  Top 0.254: U4.5 10.92,32.39 10.92,30.23 12.19,28.96 12.19,27.43 13.21,26.42 R7.2
OSC_CLK_OUT  (via drill 0.33)
  Top 0.152: v27.51,8.33 27.23,8.61 27.23,9.37 26.82,9.78 J2.67
  Bottom 0.152: J2.67 26.82,9.78 27.23,9.37 27.23,8.61 v27.51,8.33
PSW  (via drill 0.33)
  Top 0.152: v29.21,19.53 29.18,19.56 28.17,19.56 27.86,19.25 27.05,19.25 26.78,18.98 J2.21
  Bottom 0.152: J2.21 26.78,18.98 27.05,19.25 27.86,19.25 28.17,19.56 29.18,19.56 v29.21,19.53
PWRBTN#  (via drill 0.33)
  Top 0.152: v28.19,20.52 27.53,19.86 26.8,19.86 26.71,19.78 J2.17
  Bottom 0.152: J2.17 26.71,19.78 26.8,19.86 27.53,19.86 v28.19,20.52
RCVR_MODE  (via drill 0.33)
  Top 0.152: v28.65,17.55 28.12,17.55 27.89,17.32 26.92,17.32 26.58,16.98 J2.31
  Bottom 0.152: J2.31 26.58,16.98 26.92,17.32 27.89,17.32 28.12,17.55 v28.65,17.55
RESET_OUT#  (via drill 0.33)
  Top 0.152: J2.36 22.25,16.18 21.82,15.75 20.5,15.75 v20.27,15.98
  Bottom 0.152: v20.27,15.98 20.5,15.75 21.82,15.75 22.25,16.18 J2.36
SCL  (via drill 0.6 pad 0.25)
  Top 0.254: U3.8 15.65,50.9 15.49,51.05 14.99,51.05 14.73,50.8 14.73,38.86 12.45,36.58 12.45,35.81 | R3.2 9.23,33.27 10.41,33.27 10.92,33.78 11.18,33.78 11.91,34.52 U4.2 | 11.94,35.18 U4.2 | 12.45,35.81 11.91,35.81 U4.2 | v8.64,38.1 6.86,39.88 6.86,46.01 5.61,47.26 U2.SCK | v13.72,36.07 12.7,36.07 12.45,35.81
  Bottom 0.254: v8.64,38.1 11.68,38.1 v13.72,36.07
SDA
  Top 0.254: U3.7 16.9,50.92 15.75,52.07 14.99,52.07 13.72,50.8 13.72,39.62 11.43,37.34 | R4.2 9.14,34.71 9.14,34.29 11.18,34.29 11.41,34.53 U4.3 11.43,35.17 11.43,37.34 | 11.43,37.34 7.37,41.4 7.37,45.97 8.61,47.22 U2.DATA
USB_DN  (via drill 0.33)
  Top 0.152: J2.18 22.38,19.78 22.25,19.91 20.5,19.91 19.86,20.55 v19.86,20.95
  Bottom 0.152: v19.86,20.95 19.86,20.55 20.5,19.91 22.25,19.91 22.38,19.78 J2.18
USB_DP  (via drill 0.33)
  Top 0.152: J2.16 22.42,20.18 22.38,20.22 21.13,20.22 v20.78,20.57
  Bottom 0.152: v20.78,20.57 21.13,20.22 22.38,20.22 22.42,20.18 J2.16
USB_ID  (via drill 0.33)
  Top 0.152: v27.51,22.86 27.23,22.58 J2.3
  Bottom 0.152: J2.3 27.23,22.58 v27.51,22.86
USB_VBUS  (via drill 0.33)
  Top 0.152: v19.48,19.99 19.86,19.61 22.07,19.61 22.3,19.38 J2.20
  Bottom 0.152: J2.20 22.3,19.38 22.07,19.61 19.86,19.61 v19.48,19.99
V_BAT_BKUP  (via drill 0.33)
  Top 0.152: v28.45,18.87 28.37,18.95 27.18,18.95 26.81,18.58 J2.23
  Bottom 0.152: J2.23 26.81,18.58 27.18,18.95 28.37,18.95 v28.45,18.87
VBAT
  Top 0.254: C2.1 6.07,16.85 U1.3 4.83,17.85 | 4.83,17.85 3.74,17.85 JP2.2 | 4.83,17.85 4.83,21.08 5.33,21.59 C3.1 6.47,23.18 U$1.3 6.13,23.11 6.86,23.11 7.37,23.62 7.37,24.64 6.92,25.08 U$1.1
VSYS  (via drill 0.33)
  other vias: 22.1,23.32
  pour Bottom: 21.72,22.71 21.69,23.5 21.92,23.72 22.28,23.72 22.5,23.5 22.5,23.32 22.73,23.09 23.88,23.09 23.88,22 22.45,22 22.45,22.38 22.12,22.71
  pour Top: 21.72,22.71 21.69,23.5 21.92,23.72 22.28,23.72 22.5,23.5 22.5,23.32 22.73,23.09 23.88,23.09 23.88,22 22.45,22 22.45,22.38 22.12,22.71

### Text on the board
tPlace: Weather Block
bPlace: Weather Block
tNames: +
tDocu: Note: Units are in Inches | Engineer